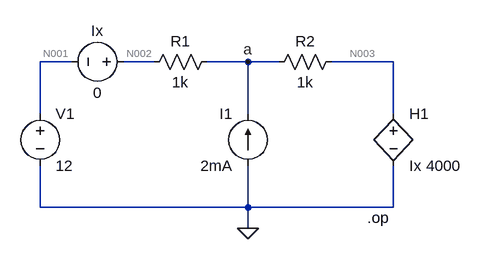
[diagram p0: schematic Draft2.asc]
Draft2.asc, the LTspice schematic file:
Version 4
SHEET 1 880 680
WIRE 128 64 80 64
WIRE 256 64 208 64
WIRE 400 64 336 64
WIRE 448 64 400 64
WIRE 624 64 528 64
WIRE 80 144 80 64
WIRE 400 144 400 64
WIRE 624 144 624 64
WIRE 80 288 80 224
WIRE 400 288 400 224
WIRE 400 288 80 288
WIRE 624 288 624 224
WIRE 624 288 400 288
WIRE 400 320 400 288
FLAG 400 320 0
FLAG 400 64 a
SYMBOL voltage 80 128 R0
SYMATTR InstName V1
SYMATTR Value 12
SYMBOL current 400 224 R180
WINDOW 0 24 80 Left 2
WINDOW 3 24 0 Left 2
SYMATTR InstName I1
SYMATTR Value 2mA
SYMBOL res 352 48 R90
WINDOW 0 0 56 VBottom 2
WINDOW 3 32 56 VTop 2
SYMATTR InstName R1
SYMATTR Value 1k
SYMBOL res 544 48 R90
WINDOW 0 0 56 VBottom 2
WINDOW 3 32 56 VTop 2
SYMATTR InstName R2
SYMATTR Value 1k
SYMBOL voltage 224 64 R90
WINDOW 0 -32 56 VBottom 2
WINDOW 3 32 56 VTop 2
SYMATTR InstName Ix
SYMATTR Value 0
SYMBOL h 624 128 R0
SYMATTR InstName H1
SYMATTR Value Ix 4000
TEXT 584 304 Left 2 !.op

The netlist it stands for:
* Draft2.asc
V1 N001 0 12
I1 0 a 2mA
R1 a N002 1k
R2 N003 a 1k
V§Ix N002 N001 0
H1 N003 0 Ix 4000
.op
.backanno
.end

* Results of the author's LTspice run, read from the files saved beside the schematic
* Operating Point:
*   V(n001) = 12 V
*   V(a) = 17 V
*   V(n002) = 12 V
*   V(n003) = 20 V
*   I(H1) = -3 mA
*   I(I1) = 2 mA
*   I(R1) = 5 mA
*   I(R2) = 3 mA
*   I(V1) = 5 mA
*   I(Ix) = 5 mA